# Altium project TVC_PWR.PrjPcb
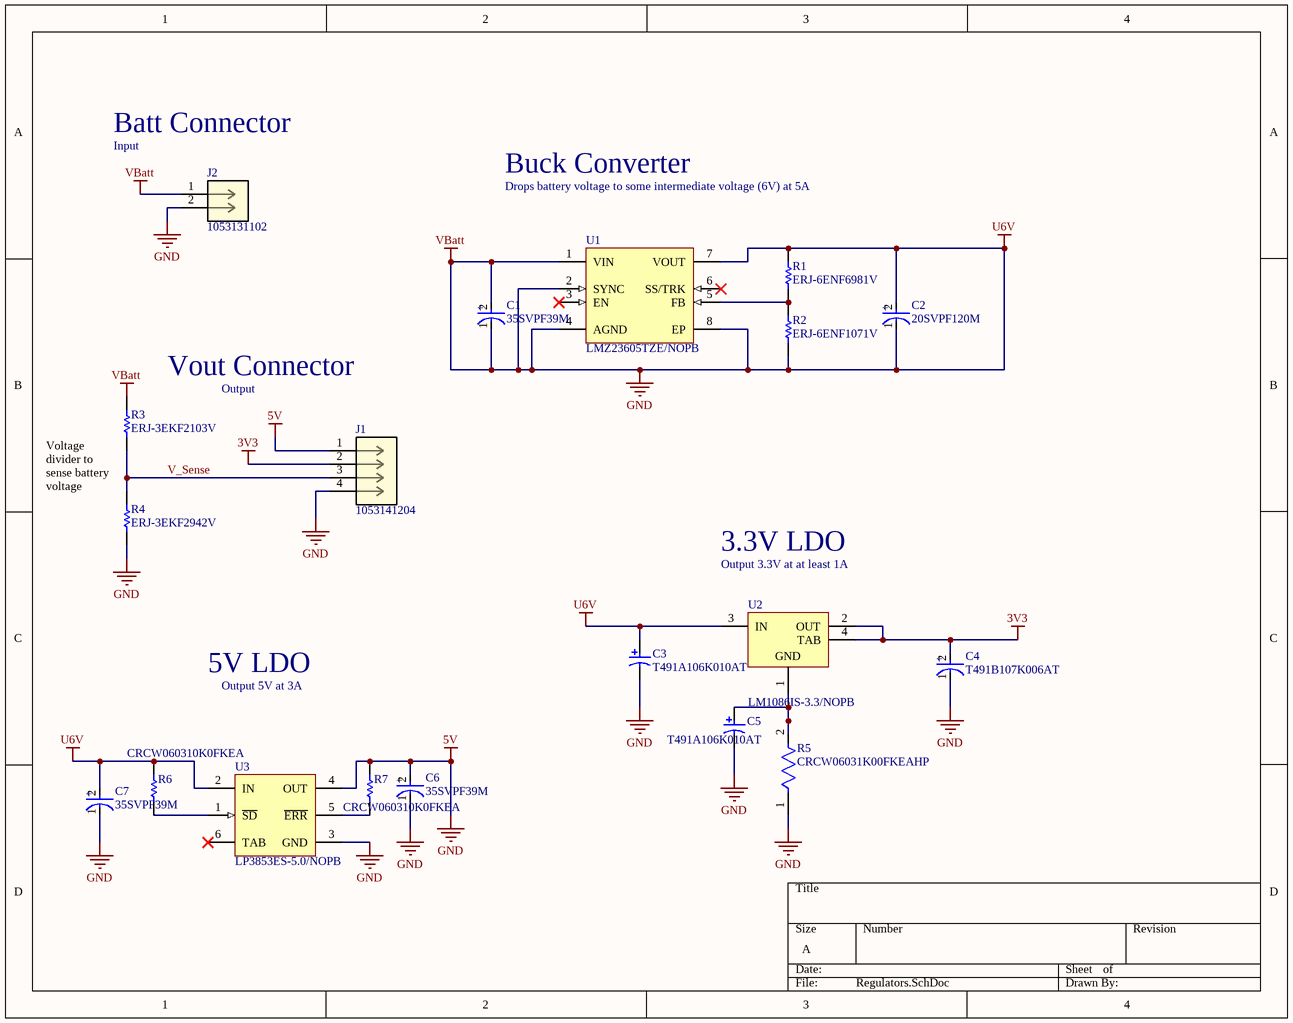
[diagram p0: Regulators.SchDoc]
1 sheet, 19 parts. Net scope: global (net labels, ports and power ports of the same name join across sheets).
Board file: Power_Board.PcbDoc

## Sheet Regulators.SchDoc
size A; SheetNumber: 1; SheetTotal: 1

### Parts
C1  35SVPF39M  [FP-OS-CON-SMT-E7-MFG]
C2  20SVPF120M  [FP-OS-CON-SMT-C6-MFG]
C3  T491A106K010AT  [KEMT-A-3216-18-2_M]
C4  T491B107K006AT  [FP-T491B107K006AT-MFG]
C5  T491A106K010AT  [KEMT-A-3216-18-2_M]
C6  35SVPF39M  [FP-OS-CON-SMT-E7-MFG]
C7  35SVPF39M  [FP-OS-CON-SMT-E7-MFG]
J1  1053141204  [CON_1053141204]
J2  1053131102  [CON_1053131102]
R1  ERJ-6ENF6981V  [RESC2013X70X40NL20T20]
R2  ERJ-6ENF1071V  [RESC2013X70X40NL20T20]
R3  ERJ-3EKF2103V  [RESC1608X55X30NL15T15]
R4  ERJ-3EKF2942V  [RESC1608X55X30NL15T15]
R5  CRCW06031K00FKEAHP  [FP-CRCW0603-HPe3-IPC_B]
R6  CRCW060310K0FKEA  [RESC1609X50X30LL8T20]
R7  CRCW060310K0FKEA  [RESC1609X50X30LL8T20]
U1  LMZ23605TZE/NOPB  [NDW0007A_V]
U2  LM1086IS-3.3/NOPB  [KTT0003B_M]
U3  LP3853ES-5.0/NOPB  [KTT0005B_N]

### Nets
3V3: C4.2(A) J1.2 U2.2(OUT) U2.4(TAB)
5V: C1.1(C) C1.2(A) C2.1(C) C2.2(A) C3.1 C3.2 C4.1(C) C5.2 C6.1(C) C6.2(A) C7.1(C) C7.2(A) J1.1 J1.4 J2.1 J2.2 R1.2 R2.1 R3.2 R4.1 R5.1 R6.2 R7.2 U1.1(VIN) U1.2(SYNC) U1.4(AGND) U1.7(VOUT) U1.8(EP) U2.3(IN) U3.2(IN) U3.3(GND) U3.4(OUT)  [also labelled GND, U6V, VBatt]
V_Sense: J1.3 R3.1 R4.2
NetC5_1: C5.1 R5.2 U2.1(GND)
NetR1_1: R1.1 R2.2 U1.5(FB)
NetR6_1: R6.1 U3.1(~{SD})
NetR7_1: R7.1 U3.5(~{ERR})

Not connected (* = marked no-connect by the designer): U1 3(EN)* 6(SS/TRK)*; U3 6(TAB)*

### Notes on the sheet
- Batt Connector
- Input
- Buck Converter
- Drops battery voltage to some intermediate voltage (6V) at 5A
- Vout Connector
- Output
- Voltage divider to sense battery voltage
- 3.3V LDO
- Output 3.3V at at least 1A
- 5V LDO
- Output 5V at 3A
- (in symbol CMP-03017-000031-1) +
- (in symbol CMP-05428-001333-1) +
- (in symbol CMP-05428-001379-1) +

### Library data of the parts
C1 C6 C7 = CMP-05428-001379-1: Conductive Polymer Aluminum Solid Capacitors (OS-CON) 39uF ±20% 35V RADIAL SMT 8x6.9mm; Ripple Current: 2.8A; Life (Hours): 5000Hour; Polarity: Polar; ESR (Equivalent Series Resistance): 30mR; Dissipation Factor: 12%; Leakage Current: 273uA; Height: 6.9mm; Tolerance: 20%; Series: OS-CON™, SVPF; Lead Free: Lead Free; Diameter: 8mm; Case/Package: Radial; Voltage: 35V; Package Quantity: 1000; Min Operating Temperature: -55°C; Packaging: Tape and Reel; Height - Seated (Max): 0.276inch; Voltage Rating (DC): 35V; Ripple Current (AC): 2.8A; Termination: SMD/SMT; Number of Pins: 7; Max Operating Temperature: 105°C; Voltage Rating: 35V; RoHS Compliant: Yes; REACH SVHC: No SVHC; Length: 6.9mm; Capacitance: 39uF; Mount: Surface Mount
C2 = CMP-05428-001333-1: Conductive Polymer Aluminum Solid Capacitors (OS-CON) 120uF ±20% 20V; Polarity: Polar; ESR (Equivalent Series Resistance): 25mR; Leakage Current: 480uA; Ripple Current: 3.2A; Life (Hours): 5000Hour; Dissipation Factor: 12%; Lead Free: Lead Free; Voltage Rating: 20V; Packaging: Tape and Reel; Min Operating Temperature: -55°C; Tolerance: 20%; Diameter: 6.3mm; Max Operating Temperature: 105°C; Length: 5.9mm; Termination: SMD/SMT; Height - Seated (Max): 0.236inch; REACH SVHC: No SVHC; Voltage Rating (DC): 20V; Voltage: 20V; Material: Polymer; Ripple Current (AC): 3.2A; Series: OS-CON™, SVPF; RoHS Compliant: Yes; Mount: Surface Mount; Height: 5.9mm; Package Quantity: 1000; Radiation Hardening: No; Construction: Cylindrical; Case/Package: Radial; Capacitance: 120uF; Number of Pins: 6
C3 C5 = CMP-2000-05172-1: Capacitor, Tantalum, 10 uF, +/- 10%, 10 V, -55 to 125 degC, 2-Pin SMD (1206), RoHS, Tape and Reel; Manufacturer Size Code: A; Manufacturer: Kemet; Type: Molded; Online Catalog: T491Series; Other Names: 399-3684-2; Voltage - Rated: 10V; Lifetime @ Temp.: 2000Hrs@85degC; Product Training Modules: CapacitorBasics-TypicalUsesforCapacitorsDeratingGuidelinesforSurfaceMountTantalumCapacitors; ESR (Equivalent Series Resistance): 3.8Ohm; Capacitance: 10µF; Catalog Drawings: T49x,T5xxSeries_A-side1T49x,T5xxSeries_A,B-side2T49x,T5xxSeries_A,SBottom; Family: TantalumCapacitors; Manufacturer URL: http://www.kemet.com/; Datasheet URL: http://www.farnell.com/datasheets/1824869.pdf; Package Reference: 1206; Packaging: Tape&Reel(TR); Series: T491; Operating Temperature: -55degC~125degC; Mounting Type: SurfaceMount; Height - Seated (Max): 0.071"(1.80mm); Package / Case: 1206(3216Metric); Package Description: 2-Pin Surface Mount Device, Body 3.2 x 1.6 mm; Features: GeneralPurpose; Tolerance: ±10%; Lead Spacing: -; Size / Dimension: 0.126"Lx0.063"W(3.20mmx1.60mm); Standard Package: 2,000; Datasheet Version: Apr-14; Category: Capacitors
C4 = CMP-03017-000031-1: CAP TANT 100UF 10% 6.3V 1411; Voltage Rating (DC): 6V; ESR (Equivalent Series Resistance): 3R; Dielectric Material: Tantalum; Leakage Current: 6.3uA; Dissipation Factor: 15%; Polarity: Polar; Life (Hours): 2000Hour; Case Code (Imperial): 1411; Voltage: 6.3V; Radiation Hardening: No; Failure Rate: 0.001%; Max Operating Temperature: 125°C; Min Operating Temperature: -55°C; Voltage Rating: 6.3V; Length: 3.5mm; Depth: 2.8mm; Package Quantity: 1; Case/Package: 1411; Height - Seated (Max): 0.083inch; Termination: SMD/SMT; REACH SVHC: No SVHC; Width: 2.8mm; Mount: Surface Mount; Number of Pins: 2; Case Code (Metric): 3528; Tolerance: 10%; Lead Free: Lead Free; Capacitance: 100uF; Features: General Purpose; Height: 1.9mm; Packaging: Tape and Reel; RoHS Compliant: Yes
J1 = 1053141204: No Description Available; Mfr_Name: Molex Connector Corporation; Copyright: Copyright (C) 2022 Ultra Librarian. All rights reserved.; Manufacturer_Part_Number: 1053141204; RefDes: RefDes; Type: DEV
J2 = 1053131102: No Description Available; Mfr_Name: Molex Connector Corporation; Copyright: Copyright (C) 2022 Ultra Librarian. All rights reserved.; Manufacturer_Part_Number: 1053131102; RefDes: RefDes; Type: DEV
R1 = CMP-2001-00277-1: Manufacturer: Panasonic; Part Number: ERJ-6ENF6981V
R2 = CMP-2001-04388-1: Manufacturer: Panasonic; Part Number: ERJ-6ENF1071V
R3 = CMP-2000-00329-1: Manufacturer: Panasonic; Part Number: ERJ-3EKF2103V
R4 = CMP-2000-00409-1: Manufacturer: Panasonic; Part Number: ERJ-3EKF2942V
R5 = CMP-2000-02970-2: RES Thick Film, 1kΩ, 1%, 0.33W, 100ppm/°C, 0603; Max Power Dissipation: 250mW; Voltage Rating (DC): 75V; Resistance: 1kR; Number of Terminations: 2; Min Operating Temperature: -55°C; Contact Plating: Tin; Termination: SMD/SMT; Weight: 7.1E-05oz; Height: 0.45mm; Radiation Hardening: No; Package Quantity: 10; Case Code (Imperial): 0603; Packaging: Tape and Reel; Max Operating Temperature: 155°C; Case/Package: 0603; Lead Free: Lead Free; Military Standard: Not; Mount: Surface Mount; Power Rating: 250mW; Length: 1.6mm; Features: Automotive AEC-Q200; Number of Pins: 2; Voltage Rating: 75V; Temperature Coefficient: 100ppm/°C; Depth: 0.85mm; Tolerance: 1%; Composition: Thick Film; Width: 0.8mm; Case Code (Metric): 1608
R6 R7 = CMP-1666-00005-4: Chip Resistor, 10 KOhm, +/- 1%, 100 mW, -55 to 155 degC, 0603 (1608 Metric), RoHS, Tape and Reel; Manufacturer: Vishay Semiconductor; Voltage Rating: 75 V; Max Operating Temperature: 155 degC; PackageDescription: 2-Pin Surface Mount Device, Body 1.575 x 0.85 mm; ComponentLink1Description: Manufacturer URL; RoHSCompliant: true; PackageReference: 0603; REACH SVHC: Unknown; Length: 1.55 mm; DatasheetVersion: 06/2012; Packaging: Tape and Reel; Min Operating Temperature: -55 degC; Mounting Technology: Surface Mount; ComponentLink2URL: https://datasheet.ciiva.com/11809/0900766b80d98afc-11809037.pdf; Height: 0.45 mm; ComponentLink2Description: Datasheet; Package Quantity: 5000; ComponentLink1URL: http://www.vishay.com/
U1 = CMP-0069-02071-2: 5A SIMPLE SWITCHER® Power Module with 36V Maximum Input Voltage, 7 pin TO-PMOD, 250 Reel; Manufacturer: Texas Instruments; PowerWise: N; PackageTopMarking: NSUZXYTTE#*LMZ23605; PackageReference: NDW0007A; PackageDescription: TO-PMOD-7, 10.16 x 9.85 x 4.57 mm Body, 7 Lead, 1.27mm Pitch, Surface Mount; RoHS: Y; ComponentLink1Description: Datasheet URL; CompType: Switcher; ComponentLink1URL: http://www.ti.com/general/docs/lit/getliterature.tsp?genericPartNumber=LMZ23605&fileType=pdf; PinCount: 7
U2 = CMP-0062-00552-5: 1.5A Low Dropout Positive Regulators, 3-pin TO-263, Pb-Free; Manufacturer: Texas Instruments; PowerWise: N; CompType: LDO IC; PackageTopMarking: NSUZXYTTE#*LM1086*IS-3.3; High-Reliability: Y; PackageReference: KTT0003B; PartNumber: LM1086IS-3.3/NOPB; PackageDescription: TO-263, Molded, .400 x .390 x .180in, 3 Lead, .1in Pitch, Surface Mount; ComponentLink1URL: http://www.ti.com/general/docs/lit/getliterature.tsp?genericPartNumber=LM1086&fileType=pdf; RoHS: Y; Code_JEDEC: MO-169-AA; ComponentLink1Description: Datasheet URL; PinCount: 3
U3 = CMP-0062-00142-3: 3A Fast Ultra Low Dropout Linear Regulator, 5-pin TO-263, Pb-Free; Manufacturer: Texas Instruments; CompType: LDO IC; PowerWise: N; PackageTopMarking: NSUZXYTTE#*LP3853ES*-5.0; PackageReference: KTT0005B; ComponentLink1URL: http://www.ti.com/general/docs/lit/getliterature.tsp?genericPartNumber=LP3853&fileType=pdf; ComponentLink1Description: Datasheet URL; PinCount: 5; Code_JEDEC: MO-169-AB; RoHS: Y; PackageDescription: TO-263, Molded, .400 x .390 x .180in, 5 Lead, .067in Pitch, Surface Mount